# Altium schematic sheet Metlino_MCH.SchDoc: Metlino
size 420 x 297 mm; CheckedBy: P.Kulik,T.Przywozki,W.Ruclo; Author: G.Kasprowicz; CompanyName: WUT ISE; DrawnBy: G.Kasprowicz; Organization: WUT ISE; Address1: PW ISE; Address2: Nowowiejska 15/19 00-665 Warsaw; Address3: gkasprow@gmail.com; DocumentNumber: 1; Revision: 2; SheetNumber: 1; SheetTotal: 29; ModifiedBy: -; CheckedDate: -; Title2: Top; DivGrp: WUT ISE; Designer: G.Kasprowicz; ModifiedDate: -; ProjectName: Sensor Box
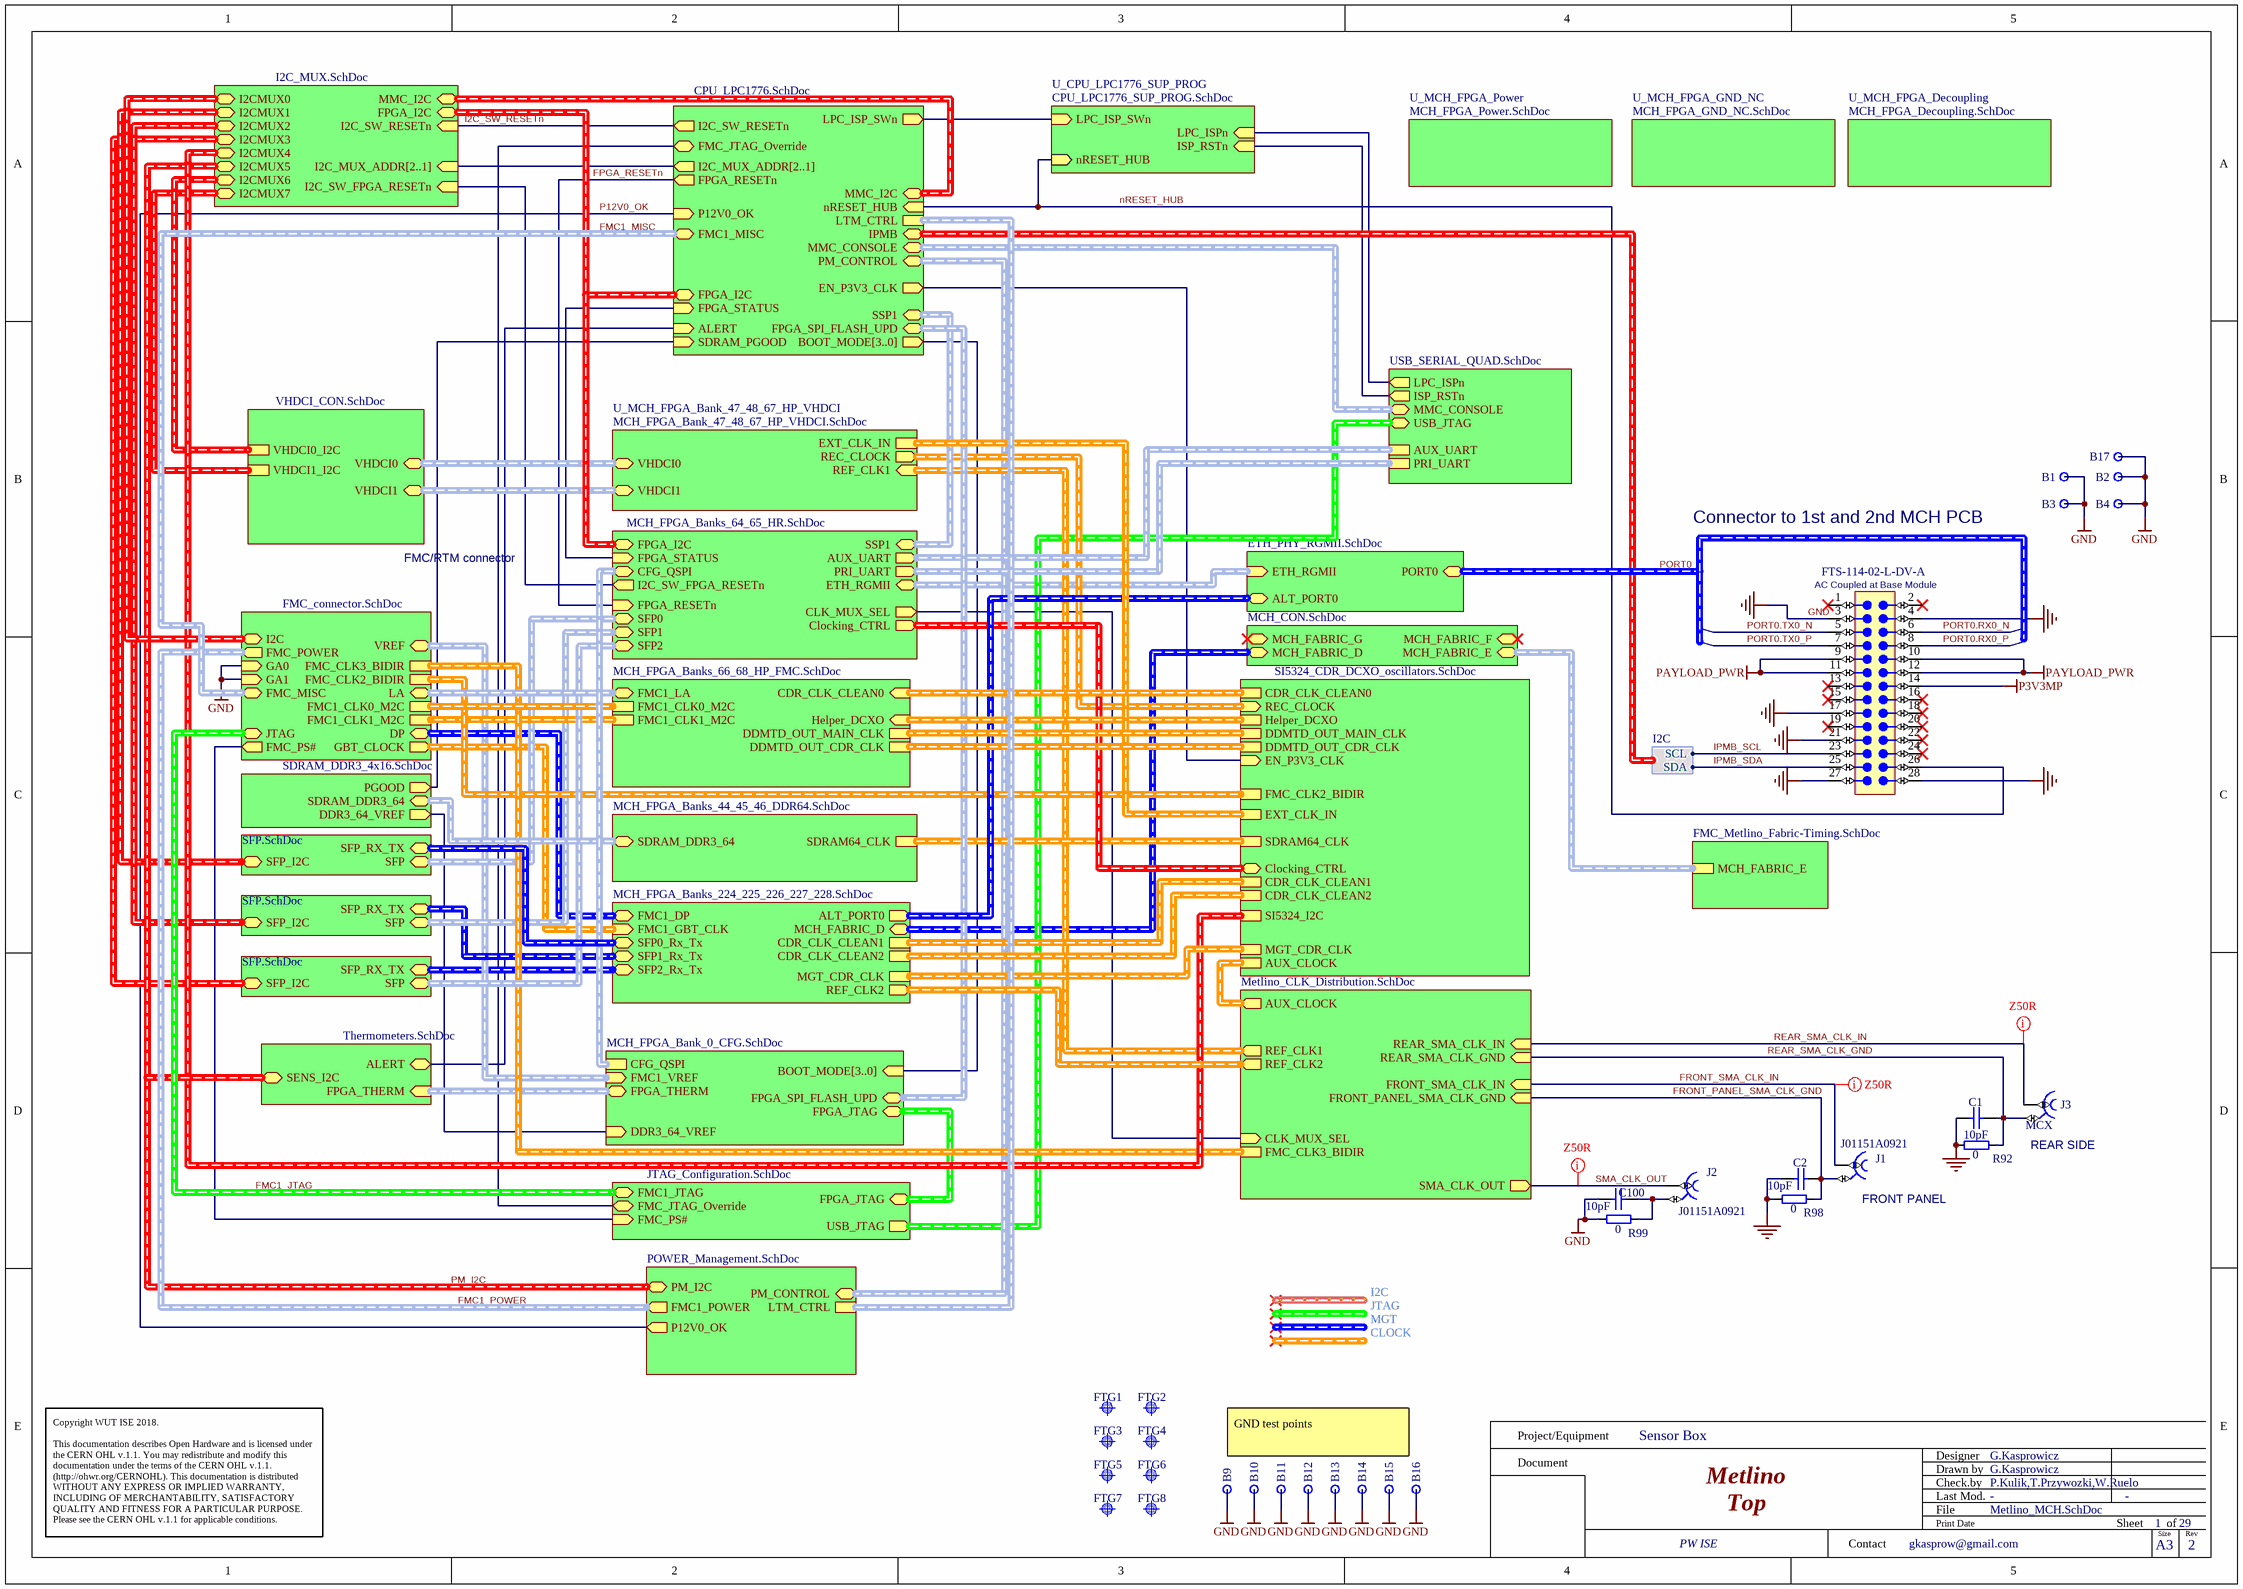
[diagram p0: Metlino_MCH.SchDoc]

## Parts
B1  Plated Hole  [MTG320_550]  (value not drawn)  (no BOM)
B2  Plated Hole  [MTG320_550]  (value not drawn)  (no BOM)
B3  Plated Hole  [MTG320_550]  (value not drawn)  (no BOM)
B4  Plated Hole  [MTG320_550]  (value not drawn)  (no BOM)
B9  Plated Hole  [c130h80]  (value not drawn)  (no BOM)
B10  Plated Hole  [c130h80]  (value not drawn)  (no BOM)
B11  Plated Hole  [c130h80]  (value not drawn)  (no BOM)
B12  Plated Hole  [c130h80]  (value not drawn)  (no BOM)
B13  Plated Hole  [c130h80]  (value not drawn)  (no BOM)
B14  Plated Hole  [c130h80]  (value not drawn)  (no BOM)
B15  Plated Hole  [c130h80]  (value not drawn)  (no BOM)
B16  Plated Hole  [c130h80]  (value not drawn)  (no BOM)
B17  Plated Hole  [MTG320_550]  (value not drawn)  (no BOM)
C1  10pF  [CAPC1608X87N]
C2  10pF  [CAPC1608X87N]
C100  10pF  [CAPC1608X87N]
FTG1  Use only in PCB  [FIDUCIAL_TOP_C100-200]  (value not drawn)
FTG2  Use only in PCB  [FIDUCIAL_TOP_S100-200]  (value not drawn)
FTG3  Use only in PCB  [FIDUCIAL_TOP_C100-200]  (value not drawn)
FTG4  Use only in PCB  [FIDUCIAL_TOP_S100-200]  (value not drawn)
FTG5  Use only in PCB  [FIDUCIAL_TOP_C100-200]  (value not drawn)
FTG6  Use only in PCB  [FIDUCIAL_TOP_S100-200]  (value not drawn)
FTG7  Use only in PCB  [FIDUCIAL_TOP_C100-200]  (value not drawn)
FTG8  Use only in PCB  [FIDUCIAL_TOP_S100-200]  (value not drawn)
J1  Manufacturer Part Number: J01151A0921  [TELEGARTNER_J01151A0921]  (hidden comment: SMA)
J2  Manufacturer Part Number: J01151A0921  [TELEGARTNER_J01151A0921]  (hidden comment: SMA)
J3  MCX  [AMPHENOL_ARF2521-ND]
J4  Manufacturer Part Number: FTS-114-02-L-DV-A  [SAMTEC_FTS-114-02-L-DV-A]  (hidden comment: Header 28)
R92  0  [RESC1608X55N]
R98  0  [RESC1608X55N]
R99  0  [RESC1608X55N]

## Sub-sheets
ETH_PHY_RGMII = ETH_PHY_RGMII.SchDoc: ETH_RGMII (in, harness ETH_RGMII), PORT0 (bidir, harness MGTx1), ALT_PORT0 (bidir, harness MGTx1)  | CmpIndex: 10; Name: ETH_PHY; SymIndex: 1511
FMC_connector = FMC_connector.SchDoc: GBT_CLOCK (out, harness FMC_GBT_CLK), VREF (bidir, harness FMC_VREF), JTAG (bidir, harness JTAG), FMC_MISC (bidir, harness FMC_MICS), I2C (bidir, harness I2C), LA (bidir, harness FMC_LA), DP (bidir, harness FMC_DP), FMC_POWER (out, harness FMC_POWER), FMC1_CLK1_M2C (harness DIFF_CLK), FMC1_CLK0_M2C (harness DIFF_CLK), GA0 (in), GA1 (in), FMC_CLK3_BIDIR (harness DIFF_CLK), FMC_CLK2_BIDIR (harness DIFF_CLK), FMC_PS# (out)  | $$NotCommonProperty_SHEETNAME: HPC1; CmpIndex: 113; Name: FMC_HPC; SHEETNAME: SHEETNAME; SymIndex: 792
FMC_Metlino_Fabric-Timing = FMC_Metlino_Fabric-Timing.SchDoc: MCH_FABRIC_E
I2C_MUX = I2C_MUX.SchDoc: FPGA_I2C (bidir, harness I2C), MMC_I2C (bidir, harness I2C), I2CMUX7 (bidir, harness I2C), I2CMUX6 (bidir, harness I2C), I2CMUX5 (bidir, harness I2C), I2CMUX3 (bidir, harness I2C), I2CMUX2 (bidir, harness I2C), I2CMUX1 (bidir, harness I2C), I2CMUX0 (bidir, harness I2C), I2C_SW_RESETn (in), I2CMUX4 (bidir, harness I2C), I2C_MUX_ADDR[2..1] (in), I2C_SW_FPGA_RESETn (in)  | CmpIndex: 4; Name: I2C_MUX10055; SymIndex: 1875
JTAG_Configuration = JTAG_Configuration.SchDoc: FMC1_JTAG (bidir, harness JTAG), FPGA_JTAG (bidir, harness FPGA_JTAG), USB_JTAG (out, harness USB_JTAG), FMC_PS# (in), FMC_JTAG_Override (bidir)  | $$NotCommonProperty_SHEETNAME: JTAG_CONF; CmpIndex: 107; Name: JTAG_CONF; SHEETNAME: SHEETNAME; SymIndex: 798
MCH_CON = MCH_CON.SchDoc: MCH_FABRIC_E (bidir, harness MCH_FABRIC_E), MCH_FABRIC_D (bidir, harness MCH_FABRIC_D), MCH_FABRIC_F (bidir, harness MCH_FABRIC_F), MCH_FABRIC_G (bidir, harness MCH_FABRIC_G)  | CmpIndex: 102; Name: MCH_CON; SymIndex: 1698
Metlino_CLK_Distribution = Metlino_CLK_Distribution.SchDoc: FRONT_SMA_CLK_IN (in), SMA_CLK_OUT (out), CLK_MUX_SEL (in), REAR_SMA_CLK_IN (in), REAR_SMA_CLK_GND (in), FRONT_PANEL_SMA_CLK_GND (in), REF_CLK1 (out, harness DIFF_CLK), AUX_CLOCK (out, harness DIFF_CLK), FMC_CLK3_BIDIR (harness DIFF_CLK), REF_CLK2 (out, harness DIFF_CLK)  | CmpIndex: 87; Name: Metlino_CLK_Distribution; SymIndex: 1758
POWER_Management = POWER_Management.SchDoc: FMC1_POWER (out, harness FMC1_POWER), PM_CONTROL (bidir, harness PM_CONTROL), PM_I2C (bidir, harness I2C), P12V0_OK (out), LTM_CTRL (harness LTM_CTRL)  | $$NotCommonProperty_SHEETNAME: PWR_MGT; CmpIndex: 105; Name: PWR_MGT; SHEETNAME: SHEETNAME; SymIndex: 796
SDRAM_DDR3_4x16 = SDRAM_DDR3_4x16.SchDoc: PGOOD (out), SDRAM_DDR3_64 (bidir, harness SDRAM_DDR3_64), DDR3_64_VREF (out)  | CmpIndex: 111; SymIndex: 276
SFP0 = SFP.SchDoc: SFP (bidir, harness SFP_CTL), SFP_RX_TX (bidir, harness SFP_MGT), SFP_I2C (bidir, harness I2C)  | CmpIndex: 116; SymIndex: 1422
SFP1 = SFP.SchDoc: SFP (bidir, harness SFP_CTL), SFP_RX_TX (bidir, harness SFP_MGT), SFP_I2C (bidir, harness I2C)  | CmpIndex: 119; SymIndex: 1422
SFP2 = SFP.SchDoc: SFP (bidir, harness SFP_CTL), SFP_RX_TX (bidir, harness SFP_MGT), SFP_I2C (bidir, harness I2C)  | CmpIndex: 3; SymIndex: 1422
SI5324_CLK_RECOVERY = SI5324_CDR_DCXO_oscillators.SchDoc: Clocking_CTRL (bidir, harness WR_I2C_CTRL), Helper_DCXO (harness DIFF_CLK), EXT_CLK_IN (harness DIFF_CLK), SDRAM64_CLK (harness DIFF_CLK), SI5324_I2C (harness I2C), CDR_CLK_CLEAN1 (harness DIFF_CLK), REC_CLOCK (in, harness DIFF_CLK), AUX_CLOCK (harness DIFF_CLK), FMC_CLK2_BIDIR (harness DIFF_CLK), CDR_CLK_CLEAN0 (harness DIFF_CLK), DDMTD_OUT_CDR_CLK (harness DIFF_CLK), DDMTD_OUT_MAIN_CLK (harness DIFF_CLK), MGT_CDR_CLK (harness DIFF_CLK), CDR_CLK_CLEAN2 (harness DIFF_CLK), EN_P3V3_CLK (in)  | CmpIndex: 115; Name: Si5324 Clock recovery9459912232034; SymIndex: 1416
Thermometers = Thermometers.SchDoc: ALERT (bidir), FPGA_THERM (in, harness FPGA_THERM), SENS_I2C (bidir, harness I2C)  | $$NotCommonProperty_SHEETNAME: THERMO; CmpIndex: 47; Name: THERMAL_SENSORS; SymIndex: 789
U_CPU_LPC1776 = CPU_LPC1776.SchDoc: FMC1_MISC (bidir, harness FMC_MICS), I2C_MUX_ADDR[2..1] (out), BOOT_MODE[3..0] (out), FMC_JTAG_Override (bidir), FPGA_SPI_FLASH_UPD (bidir, harness FLASH_UPD), FPGA_RESETn (out), nRESET_HUB (in), MMC_CONSOLE (bidir, harness UART), SDRAM_PGOOD (in), FPGA_I2C (bidir, harness I2C), MMC_I2C (bidir, harness I2C), IPMB (bidir, harness I2C), PM_CONTROL (bidir, harness PM_CONTROL), I2C_SW_RESETn (out), P12V0_OK (in), ALERT (in), LPC_ISP_SWn (out), SSP1 (bidir, harness SPI), FPGA_STATUS (in), LTM_CTRL (harness LTM_CTRL), EN_P3V3_CLK (out)
U_CPU_LPC1776_SUP_PROG = CPU_LPC1776_SUP_PROG.SchDoc: LPC_ISP_SWn (in), ISP_RSTn (in), LPC_ISPn (in), nRESET_HUB (in)
U_MCH_FPGA_Bank_0_CFG = MCH_FPGA_Bank_0_CFG.SchDoc: BOOT_MODE[3..0] (in), FMC1_VREF (in, harness FMC_VREF), FPGA_THERM (bidir, harness FPGA_THERM), FPGA_JTAG (bidir, harness FPGA_JTAG), FPGA_SPI_FLASH_UPD (bidir, harness FPGA_SPI_FLASH_UPD), DDR3_64_VREF (in), CFG_QSPI (harness CFG_QSPI)
U_MCH_FPGA_Bank_47_48_67_HP_VHDCI = MCH_FPGA_Bank_47_48_67_HP_VHDCI.SchDoc: REF_CLK1 (in, harness DIFF_CLK), VHDCI1 (bidir, harness VHDCI1), VHDCI0 (bidir, harness VHDCI0), REC_CLOCK (out, harness DIFF_CLK), EXT_CLK_IN (harness DIFF_CLK)
U_MCH_FPGA_Banks_44_45_46_DDR64 = MCH_FPGA_Banks_44_45_46_DDR64.SchDoc: SDRAM_DDR3_64 (bidir, harness SDRAM_DDR3_64), SDRAM64_CLK (harness DIFF_CLK)
U_MCH_FPGA_Banks_64_65_HR = MCH_FPGA_Banks_64_65_HR.SchDoc: Clocking_CTRL (out, harness WR_I2C_CTRL), SFP1 (bidir, harness SFP_CTL), CLK_MUX_SEL (out), AUX_UART (out, harness UART), PRI_UART (out, harness UART), SFP0 (bidir, harness SFP_CTL), FPGA_RESETn (in), FPGA_I2C (bidir, harness I2C), SFP2 (bidir, harness SFP_CTL), ETH_RGMII (bidir, harness ETH_RGMII), FPGA_STATUS (in), CFG_QSPI (bidir, harness CFG_QSPI), SSP1 (bidir, harness SPI), I2C_SW_FPGA_RESETn (out)
U_MCH_FPGA_Banks_66_68_HP_FMC = MCH_FPGA_Banks_66_68_HP_FMC.SchDoc: Helper_DCXO (in, harness DIFF_CLK), CDR_CLK_CLEAN0 (in, harness DIFF_CLK), FMC1_LA (bidir, harness FMC_LA), FMC1_CLK0_M2C (harness DIFF_CLK), FMC1_CLK1_M2C (harness DIFF_CLK), DDMTD_OUT_CDR_CLK (harness DIFF_CLK), DDMTD_OUT_MAIN_CLK (harness DIFF_CLK)
U_MCH_FPGA_Banks_224_225_226_227_228 = MCH_FPGA_Banks_224_225_226_227_228.SchDoc: ALT_PORT0 (out, harness MGTx1), SFP0_Rx_Tx (bidir, harness SFP_MGT), SFP1_Rx_Tx (bidir, harness SFP_MGT), MCH_FABRIC_D (bidir, harness MCH_FABRIC_D), FMC1_DP (bidir, harness FMC_DP), FMC1_GBT_CLK (in, harness FMC1_GBT_CLK), SFP2_Rx_Tx (bidir, harness SFP_MGT), CDR_CLK_CLEAN2 (harness DIFF_CLK), MGT_CDR_CLK (harness DIFF_CLK), CDR_CLK_CLEAN1 (harness DIFF_CLK), REF_CLK2 (out, harness DIFF_CLK)
U_MCH_FPGA_Decoupling = MCH_FPGA_Decoupling.SchDoc: no entries
U_MCH_FPGA_GND_NC = MCH_FPGA_GND_NC.SchDoc: no entries
U_MCH_FPGA_Power = MCH_FPGA_Power.SchDoc: no entries
USB_SERIAL_QUAD = USB_SERIAL_QUAD.SchDoc: MMC_CONSOLE (bidir, harness UART), USB_JTAG (bidir, harness USB_JTAG), LPC_ISPn (out), ISP_RSTn (out), AUX_UART (harness UART), PRI_UART (harness UART)  | CmpIndex: 121; Name: USB_UART_QUAD; SymIndex: 807
VHDCI_CON = VHDCI_CON.SchDoc: VHDCI1 (bidir, harness VHDCI1), VHDCI0 (bidir, harness VHDCI0), VHDCI1_I2C (harness I2C), VHDCI0_I2C (harness I2C)  | CmpIndex: 11; Name: VHDCI_CON; SymIndex: 1699

## Harnesses
I2C: SCL, SDA

## Nets
GND: B1.1 B2.1 B3.1 B4.1 B9.1 B10.1 B11.1 B12.1 B13.1 B14.1 B15.1 B16.1 B17.1 C1.2 C2.2 C100.2 J4.3 J4.4 J4.17 J4.21 J4.27 J4.28 R92.1 R98.1 R99.1 ; sheet FMC_connector/GA0, sheet FMC_connector/GA1
P3V3MP: J4.14
PAYLOAD_PWR: J4.9 J4.10 J4.11 J4.12
FPGA_RESETn: sheet U_CPU_LPC1776/FPGA_RESETn, sheet U_MCH_FPGA_Banks_64_65_HR/FPGA_RESETn
FRONT_PANEL_SMA_CLK_GND: C2.1 J1.2 R98.2 ; sheet Metlino_CLK_Distribution/FRONT_PANEL_SMA_CLK_GND
FRONT_SMA_CLK_IN: J1.1 ; sheet Metlino_CLK_Distribution/FRONT_SMA_CLK_IN
I2C_SW_RESETn: sheet I2C_MUX/I2C_SW_RESETn, sheet U_CPU_LPC1776/I2C_SW_RESETn
IPMB_SCL: J4.23 ; sheet U_CPU_LPC1776/IPMB.SCL
IPMB_SDA: J4.25 ; sheet U_CPU_LPC1776/IPMB.SDA
nRESET_HUB: J4.26 ; sheet U_CPU_LPC1776/nRESET_HUB, sheet U_CPU_LPC1776_SUP_PROG/nRESET_HUB
P12V0_OK: sheet POWER_Management/P12V0_OK, sheet U_CPU_LPC1776/P12V0_OK
PORT0.RX0_N: J4.6
PORT0.RX0_P: J4.8
PORT0.TX0_N: J4.5
PORT0.TX0_P: J4.7
REAR_SMA_CLK_GND: C1.1 J3.2 R92.2 ; sheet Metlino_CLK_Distribution/REAR_SMA_CLK_GND
REAR_SMA_CLK_IN: J3.1 ; sheet Metlino_CLK_Distribution/REAR_SMA_CLK_IN
SMA_CLK_OUT: J2.1 ; sheet Metlino_CLK_Distribution/SMA_CLK_OUT
NetC100_1: C100.1 J2.2 R99.2
(unnamed): sheet USB_SERIAL_QUAD/LPC_ISPn, sheet U_CPU_LPC1776_SUP_PROG/LPC_ISPn
(unnamed): sheet USB_SERIAL_QUAD/ISP_RSTn, sheet U_CPU_LPC1776_SUP_PROG/ISP_RSTn
(unnamed): sheet SI5324_CLK_RECOVERY/EN_P3V3_CLK, sheet U_CPU_LPC1776/EN_P3V3_CLK
(unnamed): sheet FMC_connector/FMC_PS#, sheet JTAG_Configuration/FMC_PS#
(unnamed): sheet SDRAM_DDR3_4x16/PGOOD, sheet U_CPU_LPC1776/SDRAM_PGOOD
(unnamed): sheet SDRAM_DDR3_4x16/DDR3_64_VREF, sheet U_MCH_FPGA_Bank_0_CFG/DDR3_64_VREF
(unnamed): sheet JTAG_Configuration/FMC_JTAG_Override, sheet U_CPU_LPC1776/FMC_JTAG_Override
(unnamed): sheet Metlino_CLK_Distribution/CLK_MUX_SEL, sheet U_MCH_FPGA_Banks_64_65_HR/CLK_MUX_SEL
(unnamed): sheet Thermometers/ALERT, sheet U_CPU_LPC1776/ALERT
(unnamed): sheet I2C_MUX/I2C_SW_FPGA_RESETn, sheet U_MCH_FPGA_Banks_64_65_HR/I2C_SW_FPGA_RESETn
(unnamed): sheet U_CPU_LPC1776/LPC_ISP_SWn, sheet U_CPU_LPC1776_SUP_PROG/LPC_ISP_SWn
(unnamed): sheet U_CPU_LPC1776/FPGA_STATUS, sheet U_MCH_FPGA_Banks_64_65_HR/FPGA_STATUS

Not connected (* = marked no-connect by the designer): J4 1* 2* 13* 15* 16* 18* 19* 20* 22* 24*

## Buses and harness runs
bus sheet I2C_MUX/I2C_MUX_ADDR[2..1] = sheet U_CPU_LPC1776/I2C_MUX_ADDR[2..1]
bus sheet U_CPU_LPC1776/BOOT_MODE[3..0] = sheet U_MCH_FPGA_Bank_0_CFG/BOOT_MODE[3..0]
harness FMC1_JTAG = sheet FMC_connector/JTAG = sheet JTAG_Configuration/FMC1_JTAG
harness FMC1_MISC = sheet FMC_connector/FMC_MISC = sheet U_CPU_LPC1776/FMC1_MISC
harness FMC1_POWER = sheet FMC_connector/FMC_POWER = sheet POWER_Management/FMC1_POWER
harness PM_I2C = sheet I2C_MUX/I2CMUX5 = sheet POWER_Management/PM_I2C = sheet Thermometers/SENS_I2C
harness PORT0 = sheet ETH_PHY_RGMII/PORT0
harness sheet ETH_PHY_RGMII/ALT_PORT0 = sheet U_MCH_FPGA_Banks_224_225_226_227_228/ALT_PORT0
harness sheet ETH_PHY_RGMII/ETH_RGMII = sheet U_MCH_FPGA_Banks_64_65_HR/ETH_RGMII
harness sheet FMC_connector/DP = sheet U_MCH_FPGA_Banks_224_225_226_227_228/FMC1_DP
harness sheet FMC_connector/FMC1_CLK0_M2C = sheet U_MCH_FPGA_Banks_66_68_HP_FMC/FMC1_CLK0_M2C
harness sheet FMC_connector/FMC1_CLK1_M2C = sheet U_MCH_FPGA_Banks_66_68_HP_FMC/FMC1_CLK1_M2C
harness sheet FMC_connector/FMC_CLK2_BIDIR = sheet SI5324_CLK_RECOVERY/FMC_CLK2_BIDIR
harness sheet FMC_connector/FMC_CLK3_BIDIR = sheet Metlino_CLK_Distribution/FMC_CLK3_BIDIR
harness sheet FMC_connector/GBT_CLOCK = sheet U_MCH_FPGA_Banks_224_225_226_227_228/FMC1_GBT_CLK
harness sheet FMC_connector/I2C = sheet I2C_MUX/I2CMUX0
harness sheet FMC_connector/LA = sheet U_MCH_FPGA_Banks_66_68_HP_FMC/FMC1_LA
harness sheet FMC_connector/VREF = sheet U_MCH_FPGA_Bank_0_CFG/FMC1_VREF
harness sheet FMC_Metlino_Fabric-Timing/MCH_FABRIC_E = sheet MCH_CON/MCH_FABRIC_E
harness sheet I2C_MUX/FPGA_I2C = sheet U_CPU_LPC1776/FPGA_I2C = sheet U_MCH_FPGA_Banks_64_65_HR/FPGA_I2C
harness sheet I2C_MUX/I2CMUX1 = sheet SFP0/SFP_I2C
harness sheet I2C_MUX/I2CMUX2 = sheet SFP1/SFP_I2C
harness sheet I2C_MUX/I2CMUX3 = sheet SFP2/SFP_I2C
harness sheet I2C_MUX/I2CMUX4 = sheet SI5324_CLK_RECOVERY/SI5324_I2C
harness sheet I2C_MUX/I2CMUX6 = sheet VHDCI_CON/VHDCI0_I2C
harness sheet I2C_MUX/I2CMUX7 = sheet VHDCI_CON/VHDCI1_I2C
harness sheet I2C_MUX/MMC_I2C = sheet U_CPU_LPC1776/MMC_I2C
harness sheet JTAG_Configuration/FPGA_JTAG = sheet U_MCH_FPGA_Bank_0_CFG/FPGA_JTAG
harness sheet JTAG_Configuration/USB_JTAG = sheet USB_SERIAL_QUAD/USB_JTAG
harness sheet MCH_CON/MCH_FABRIC_D = sheet U_MCH_FPGA_Banks_224_225_226_227_228/MCH_FABRIC_D
harness sheet Metlino_CLK_Distribution/AUX_CLOCK = sheet SI5324_CLK_RECOVERY/AUX_CLOCK
harness sheet Metlino_CLK_Distribution/REF_CLK1 = sheet U_MCH_FPGA_Bank_47_48_67_HP_VHDCI/REF_CLK1
harness sheet Metlino_CLK_Distribution/REF_CLK2 = sheet U_MCH_FPGA_Banks_224_225_226_227_228/REF_CLK2
harness sheet POWER_Management/LTM_CTRL = sheet U_CPU_LPC1776/LTM_CTRL
harness sheet POWER_Management/PM_CONTROL = sheet U_CPU_LPC1776/PM_CONTROL
harness sheet SDRAM_DDR3_4x16/SDRAM_DDR3_64 = sheet U_MCH_FPGA_Banks_44_45_46_DDR64/SDRAM_DDR3_64
harness sheet SFP0/SFP = sheet U_MCH_FPGA_Banks_64_65_HR/SFP0
harness sheet SFP0/SFP_RX_TX = sheet U_MCH_FPGA_Banks_224_225_226_227_228/SFP0_Rx_Tx
harness sheet SFP1/SFP = sheet U_MCH_FPGA_Banks_64_65_HR/SFP1
harness sheet SFP1/SFP_RX_TX = sheet U_MCH_FPGA_Banks_224_225_226_227_228/SFP1_Rx_Tx
harness sheet SFP2/SFP = sheet U_MCH_FPGA_Banks_64_65_HR/SFP2
harness sheet SFP2/SFP_RX_TX = sheet U_MCH_FPGA_Banks_224_225_226_227_228/SFP2_Rx_Tx
harness sheet SI5324_CLK_RECOVERY/CDR_CLK_CLEAN0 = sheet U_MCH_FPGA_Banks_66_68_HP_FMC/CDR_CLK_CLEAN0
harness sheet SI5324_CLK_RECOVERY/CDR_CLK_CLEAN1 = sheet U_MCH_FPGA_Banks_224_225_226_227_228/CDR_CLK_CLEAN1
harness sheet SI5324_CLK_RECOVERY/CDR_CLK_CLEAN2 = sheet U_MCH_FPGA_Banks_224_225_226_227_228/CDR_CLK_CLEAN2
harness sheet SI5324_CLK_RECOVERY/Clocking_CTRL = sheet U_MCH_FPGA_Banks_64_65_HR/Clocking_CTRL
harness sheet SI5324_CLK_RECOVERY/DDMTD_OUT_CDR_CLK = sheet U_MCH_FPGA_Banks_66_68_HP_FMC/DDMTD_OUT_CDR_CLK
harness sheet SI5324_CLK_RECOVERY/DDMTD_OUT_MAIN_CLK = sheet U_MCH_FPGA_Banks_66_68_HP_FMC/DDMTD_OUT_MAIN_CLK
harness sheet SI5324_CLK_RECOVERY/EXT_CLK_IN = sheet U_MCH_FPGA_Bank_47_48_67_HP_VHDCI/EXT_CLK_IN
harness sheet SI5324_CLK_RECOVERY/Helper_DCXO = sheet U_MCH_FPGA_Banks_66_68_HP_FMC/Helper_DCXO
harness sheet SI5324_CLK_RECOVERY/MGT_CDR_CLK = sheet U_MCH_FPGA_Banks_224_225_226_227_228/MGT_CDR_CLK
harness sheet SI5324_CLK_RECOVERY/REC_CLOCK = sheet U_MCH_FPGA_Bank_47_48_67_HP_VHDCI/REC_CLOCK
harness sheet SI5324_CLK_RECOVERY/SDRAM64_CLK = sheet U_MCH_FPGA_Banks_44_45_46_DDR64/SDRAM64_CLK
harness sheet Thermometers/FPGA_THERM = sheet U_MCH_FPGA_Bank_0_CFG/FPGA_THERM
harness sheet U_CPU_LPC1776/FPGA_SPI_FLASH_UPD = sheet U_MCH_FPGA_Bank_0_CFG/FPGA_SPI_FLASH_UPD
harness sheet U_CPU_LPC1776/MMC_CONSOLE = sheet USB_SERIAL_QUAD/MMC_CONSOLE
harness sheet U_CPU_LPC1776/SSP1 = sheet U_MCH_FPGA_Banks_64_65_HR/SSP1
harness sheet U_MCH_FPGA_Bank_0_CFG/CFG_QSPI = sheet U_MCH_FPGA_Banks_64_65_HR/CFG_QSPI
harness sheet U_MCH_FPGA_Bank_47_48_67_HP_VHDCI/VHDCI0 = sheet VHDCI_CON/VHDCI0
harness sheet U_MCH_FPGA_Bank_47_48_67_HP_VHDCI/VHDCI1 = sheet VHDCI_CON/VHDCI1
harness sheet U_MCH_FPGA_Banks_64_65_HR/AUX_UART = sheet USB_SERIAL_QUAD/AUX_UART
harness sheet U_MCH_FPGA_Banks_64_65_HR/PRI_UART = sheet USB_SERIAL_QUAD/PRI_UART

## Layout directives
net class Z50R: FRONT_SMA_CLK_IN, REAR_SMA_CLK_IN, SMA_CLK_OUT

## Notes on the sheet
- Connector to 1st and 2nd MCH PCB
- FMC/RTM connector
- (near J4) AC Coupled at Base Module
- (near J1) FRONT PANEL
- (near J3) REAR SIDE
- I2C
- JTAG
- MGT
- CLOCK
- GND test points
- Project/Equipment
- Document
- Designer
- Drawn by
- Check.by
- Copyright WUT ISE 2018.
  This documentation describes Open Hardware and is licensed under the CERN OHL v.1.1. You may redistribute and modify this documentation under the terms of the CERN OHL v.1.1. (http://ohwr.org/CERNOHL). This documentation is distributed WITHOUT ANY EXPRESS OR IMPLIED WARRANTY, INCLUDING OF MERCHANTABILITY, SATISFACTORY QUALITY AND FITNESS FOR A PARTICULAR PURPOSE. Please see the CERN OHL v.1.1 for applicable conditions.
- Contact
- File
- Last Mod.
- Print Date
- Sheet
- Size
- A3
- of
- Rev

## Library data of the parts
B1-B4 B17 = PLATED_HOLE3.2_PAD5.5: Single Terminal Socket; Part Description: Plated Through Hole: Hole Dia.=3.2mm Pad Dia.=5.5mm; Mounted: No; Part Number: PLATED_HOLE3.2_PAD5.5; Component Type: Standard (No BOM); Pin Count: 1; Family: Plated Hole; Socket: No; SMD: No; Sense: No; Status: None; ComponentHeight: 0mm; HelpURL: Undefined; Author: CERN DEM JMW; CreateDate: 01.10.2012; LatestRevisionDate: 01.10.2012; PackageDescription: Plated Through Hole: Hole Dia.=3.2mm Pad Dia.=5.5mm
B9-B16 = PLATED_HOLE0.8_PAD1.3: Single Terminal Socket; Part Description: Plated Through Hole: Hole Dia.=0.8mm Pad Dia.=1.3mm, IPC-7251 Level C; Mounted: No; Part Number: PLATED_HOLE0.8_PAD1.3; Component Type: Standard (No BOM); Pin Count: 1; Family: Plated Hole; Socket: No; SMD: No; Sense: No; Status: None; ComponentHeight: 0mm; HelpURL: Undefined; Author: CERN DEM JLC; CreateDate: 30.10.2008; LatestRevisionDate: 30.10.2008; PackageDescription: Plated Through Hole: Hole Dia.=0.8mm Pad Dia.=1.3mm, IPC-7251 Level C
C1 C2 C100 = CC0603_10PF_50V_5%_NP0: Non-polarised capacitor; Manufacturer: GENERIC; Part Description: SMD Multilayer Chip Ceramic Capacitor; Manufacturer1 Part Number: 223886715109; Tolerance: ±5%; Voltage: 50V; TC: C0G/NP0; Manufacturer Part Number: CC0603_10PF_50V_5%_NP0; Part Number: CC0603_10PF_50V_5%_NP0; Value: 10pF; Component Kind: Standard; Component Type: Standard; Pin Count: 2; Status: Preferred; Case: 0603; Mounted: Yes; Socket: No; SMD: Yes; Sense: No; Manufacturer1 Example: PHYCOMP; Manufacturer1 ComponentHeight: 0.87mm; HelpURL: \\cern.ch\dfs\Applications\Altium\Datasheets\CC0603_NP0_PHYCOMP.pdf; Author: CERN DEM JLC; CreateDate: 03.12.2007; LatestRevisionDate: 03.12.2007
FTG1 FTG3 FTG5 FTG7 = FIDUCIAL_TARGET_C100-200: Fiducial Target; Part Description: Round Fiducial Target, Top Layer, 1.0mm, Top Solder 2.0mm, Keepout =2.0mm; Mounted: No; Part Number: FIDUCIAL_TARGET_C100-200; Component Kind: Standard (No BOM); Component Type: Standard (No BOM); Pin Count: 1; Family: Fiducial; Socket: No; SMD: Yes; Sense: No; Status: None; ComponentHeight: 0mm; HelpURL: Undefined; Author: CERN DEM JLC; CreateDate: 09.02.2010; LatestRevisionDate: 04.04.2012; PackageDescription: Round Fiducial Target, Top Layer, 1.0mm, Top Solder 2.0mm, Keepout =2.0mm
FTG2 FTG4 FTG6 FTG8 = FIDUCIAL_TARGET_S100-200: Fiducial Target; Part Description: Square Fiducial Target, Top Layer, 1.0mm, Top Solder 2.0mm, Keepout =2.0mm; Mounted: No; Part Number: FIDUCIAL_TARGET_S100-200; Component Kind: Standard (No BOM); Component Type: Standard (No BOM); Pin Count: 1; Family: Fiducial; Socket: No; SMD: Yes; Sense: No; Status: None; ComponentHeight: 0mm; HelpURL: Undefined; Author: CERN DEM JLC; CreateDate: 09.02.2010; LatestRevisionDate: 04.04.2012; PackageDescription: Square Fiducial Target, Top Layer, 1.0mm, Top Solder 2.0mm, Keepout =2.0mm
J1 J2 = Telegartner_J01151A0921: Part Description: 50 Ohm SMA Right Angle PCB Jack; PressFit: No; Manufacturer: TELEGARTNER; Part Number: TELEGARTNER_J01151A0921; Component Kind: Standard; Component Type: Standard; Pin Count: 2; Family: SMA; Mounted: Yes; Socket: No; SMD: No; Sense: No; Status: None; ComponentHeight: 10.65mm; HelpURL: \\cern.ch\dfs\Applications\Altium\Datasheets\TELEGARTNER_J01151A0921.pdf; Author: CERN DEM JLC; CreateDate: 06.12.2016; LatestRevisionDate: 06.12.2016
J3 = CON_MCX: Part Description: 50 Ohms MCX Right Angle PCB Receptacle (Jack); Manufacturer: AMPHENOL; PressFit: No; Part Number: AMPHENOL_ARF2521-ND; Component Kind: Standard; Component Type: Standard; Pin Count: 2; Family: MCX; Mounted: Yes; Socket: No; SMD: No; Sense: No; Status: None; Manufacturer Part Number: AMPHENOL_ARF2521-ND; ComponentHeight: 6; HelpURL: \\cern.ch\dfs\Applications\Altium\Datasheets\AMPHENOL_34-1030-12G.pdf; Author: GK; CreateDate: 21.02.2017; LatestRevisionDate: 21.02.2017
J4 = SAMTEC_FTS-114-02-L-DV-A: Connector 28 Male; Manufacturer: SAMTEC; Part Description: 28 Contacts, Pitch 1.27mm - Dual Row Surface Mount Straight Strip Header; PressFit: No; Part Number: SAMTEC_FTS-114-02-L-DV-A; Component Kind: Standard; Component Type: Standard; Pin Count: 28; Family: Header 28; Mounted: Yes; Socket: No; Sense: No; SMD: Yes; Status: None; ComponentHeight: 3.18mm; HelpURL: \\cern.ch\dfs\Applications\Altium\Datasheets\SAMTEC_FTS-114-02-L-DV-A.pdf; Author: CERN DEM MR; CreateDate: 07.03.2016; LatestRevisionDate: 07.03.2016
R92 R98 R99 = R0603_0R_JUMPER: Resistor; Manufacturer: GENERIC; Part Description: 1A (0.05R Max DC Resistance) Zero Ohm Jumper; Manufacturer1 Part Number: NRC06Z0; PressFit: No; Manufacturer Part Number: R0603_0R_JUMPER; Part Number: R0603_0R_JUMPER; Value: 0; Component Kind: Standard; Component Type: Standard; Pin Count: 2; Status: Preferred; Case: 0603; Mounted: Yes; Sense: No; Socket: No; SMD: Yes; Manufacturer1 Example: NIC COMPONENT; Manufacturer1 ComponentHeight: 0.55mm; HelpURL: \\cern.ch\dfs\Applications\Altium\Datasheets\R0603_NIC_NRC.pdf; Author: CERN DEM JLC; CreateDate: 03.12.2007; LatestRevisionDate: 13.03.2008